# Altium schematic sheet UART.SCHDOC
size A4; DocumentNumber: 2; SheetNumber: 2; SheetTotal: 6
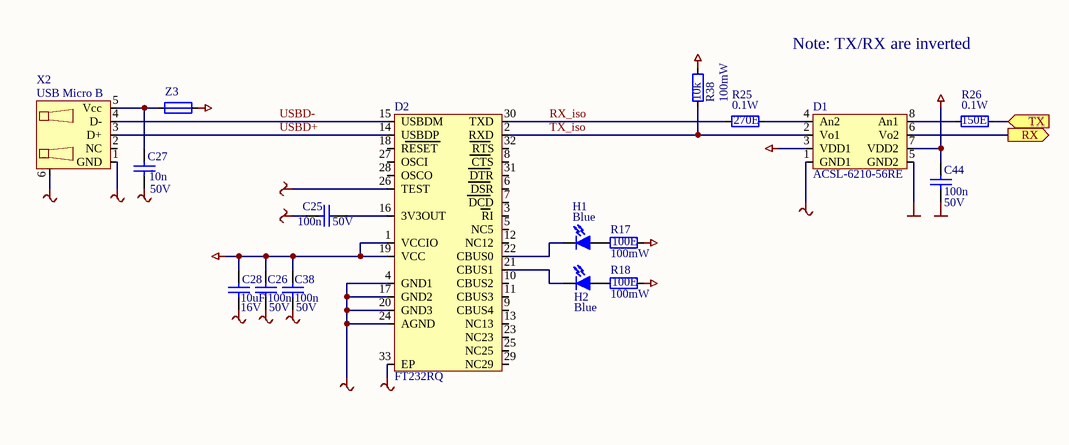
[diagram p0: UART.SCHDOC]

## Parts
C25  value 100n  Value2: 50V  [SMD_0603]  (hidden comment: C_SMD_CER_100N_50V_10%_X7R_0603)
C26  value 100n  Value2: 50V  [SMD_0603]  (hidden comment: C_SMD_CER_100N_50V_10%_X7R_0603)
C27  value 10n  Value2: 50V  [SMD_0603]  (hidden comment: C_SMD_CER_10N_50V_10%_X7R_0603)
C28  value 10uF  Value2: 16V  [SMD_0805]  (hidden comment: C_SMD_CER_10U_16V_10%_X5R_0805)
C38  value 100n  Value2: 50V  [SMD_0603]  (hidden comment: C_SMD_CER_100N_50V_10%_X7R_0603)
C44  value 100n  Value2: 50V  [SMD_0603]  (hidden comment: C_SMD_CER_100N_50V_10%_X7R_0603)
D1  Type: ACSL-6210-56RE  [SMD_SOP_8]  (hidden comment: D_ACSL-6210_SO-8)
D2  Type: FT232RQ  [SMD_QFN-32]  (hidden comment: D_FT232RQ)
H1  Type: Blue  [SMD_0603P]  (hidden comment: H_SMD_LED_BLUE_0603)
H2  Type: Blue  [SMD_0603P]  (hidden comment: H_SMD_LED_BLUE_0603)
R17  value 100E  Value2: 100mW  [SMD_0603]  (hidden comment: R_SMD_THINFILM_100E_0W1_1%_50PPM_0603)
R18  value 100E  Value2: 100mW  [SMD_0603]  (hidden comment: R_SMD_THINFILM_100E_0W1_1%_50PPM_0603)
R25  value 270E  Value2: 0.1W  [SMD_0603]  (hidden comment: R_SMD_THINFILM_270E_0W1_1%_50PPM_0603)
R26  value 150E  Value2: 0.1W  [SMD_0603]  (hidden comment: R_SMD_THINFILM_150E_0W1_1%_50PPM_0603)
R38  value 10k  Value2: 100mW  [SMD_0603]  (hidden comment: R_SMD_THINFILM_10K_0W1_1%_50PPM_0603)
X2  Type: USB Micro B  [SMD_USB_MICRO_B_2.0]  (hidden comment: X_SMD_USB_MICRO-B_2.0)
Z3  Z_SMD_FERRITE_1A5_470E@100MHZ_0603  [SMD_0603]  (value not drawn)

## Ports
RX (out), TX (in)

## Nets
+3.3V: C44.2 D1.7(VDD2)
+5Vi: C26.2 C28.2 C38.2 D1.3(VDD1) D2.1(VCCIO) D2.19(VCC) R17.2 R18.2 R38.2 Z3.2
GND: C44.1 D1.5(GND2)
GNDi: C25.1 C26.1 C27.1 C28.1 C38.1 D1.1(GND1) D2.4(GND1) D2.17(GND2) D2.20(GND3) D2.24(AGND) D2.26(TEST) D2.33(EP) X2.1(GND) X2.6(Shield)
RX: D1.6(Vo2) ; port RX
RX_iso: D2.30(TXD) R25.1
TX: R26.2 ; port TX
TX_iso: D1.2(Vo1) D2.2(RXD) R38.1
USBD+: D2.14(USBDP) X2.3(D+)
USBD-: D2.15(USBDM) X2.4(D-)
NetC25_2: C25.2 D2.16(3V3OUT)
NetC27_2: C27.2 X2.5(Vcc) Z3.1
NetD1_4: D1.4(An2) R25.2
NetD1_8: D1.8(An1) R26.1
NetD2_21: D2.21(CBUS1) H2.2
NetD2_22: D2.22(CBUS0) H1.2
NetH1_1: H1.1 R17.1
NetH2_1: H2.1 R18.1

Not connected (* = marked no-connect by the designer): D2 3(RI) 5(NC5) 6(DSR) 7(DCD) 8(CTS) 9(CBUS4) 10(CBUS2) 11(CBUS3) 12(NC12) 13(NC13) 18(RESET) 23(NC23) 25(NC25) 27(OSCI) 28(OSCO) 29(NC29) 31(DTR) 32(RTS); X2 2(NC)

## Notes on the sheet
- Note: TX/RX are inverted

## Library data of the parts
C25 C26 C38 C44 = C_SMD_CER_100N_50V_10%_X7R_0603: SMD Capacitor; Supplier - E+H-flowtec SAP: 50092748; Supplier - Digikey: 1276-1936-1-ND
C27 = C_SMD_CER_10N_50V_10%_X7R_0603: SMD Capacitor; Supplier - E+H-flowtec SAP: 50092743; Supplier - Digikey: 399-1091-1-ND
C28 = C_SMD_CER_10U_16V_10%_X5R_0805: SMD Capacitor; Supplier - E+H-flowtec SAP: 71107344; Supplier - Digikey: 490-6473-1-ND
D1 = D_ACSL-6210_SO-8: Multi-Channel and Bi-Directional 15MBd Digital Logic Gate Optocoupler; Supplier - Digikey: 516-2916-1-ND
D2 = D_FT232RQ: FT232r USB UART IC; Supplier - Digikey: 768-1008-1-ND
H1 H2 = H_SMD_LED_BLUE_0603: Blue LED, 5mA; Supplier - Digikey: VAOL-S6SB4CT-ND
R17 R18 = R_SMD_THINFILM_100E_0W1_1%_50PPM_0603: SMD Resistor; Supplier - E+H-flowtec SAP: 50092674; Supplier - Digikey: YAG2128CT-ND
R25 = R_SMD_THINFILM_270E_0W1_1%_50PPM_0603: SMD Resistor; Supplier - E+H-flowtec SAP: 50098310; Supplier - Digikey: P270DBCT-ND
R26 = R_SMD_THINFILM_150E_0W1_1%_50PPM_0603: SMD Resistor; Supplier - E+H-flowtec SAP: 50092676; Supplier - Digikey: P150DBCT-ND
R38 = R_SMD_THINFILM_10K_0W1_1%_50PPM_0603: SMD Resistor; Supplier - E+H-flowtec SAP: 50092700; Supplier - Digikey: YAG2321CT-ND
Z3 = Z_SMD_FERRITE_1A5_470E@100MHZ_0603: FERRITE CHIP 470 OHM 1500MA 0603; Value: 1.5A; Supplier - Digikey: 490-5257-1-ND; Type: BLM18KG471SN1D
X2 = X_SMD_USB_MICRO-B_2.0: Supplier - Digikey: 609-4618-1-ND